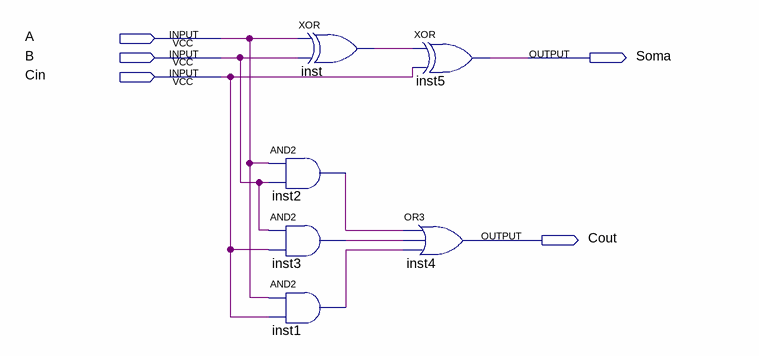
[diagram p0: schematic sheet]
// Quartus schematic SomadorCompleto.bdf as structural Verilog: 6 symbols, 5 pins
module SomadorCompleto (
  input  A,
  input  B,
  input  Cin,
  output Soma,
  output Cout
);

  wire inst1_out, inst2_out, inst3_out, inst_out;

  and inst2 (inst2_out, A, B);
  and inst3 (inst3_out, B, Cin);
  and inst1 (inst1_out, A, Cin);
  xor inst (inst_out, A, B);
  xor inst5 (Soma, inst_out, Cin);
  or inst4 (Cout, inst2_out, inst3_out, inst1_out);
endmodule
